# EAGLE design schematic1 (EAGLE 7.1.0)
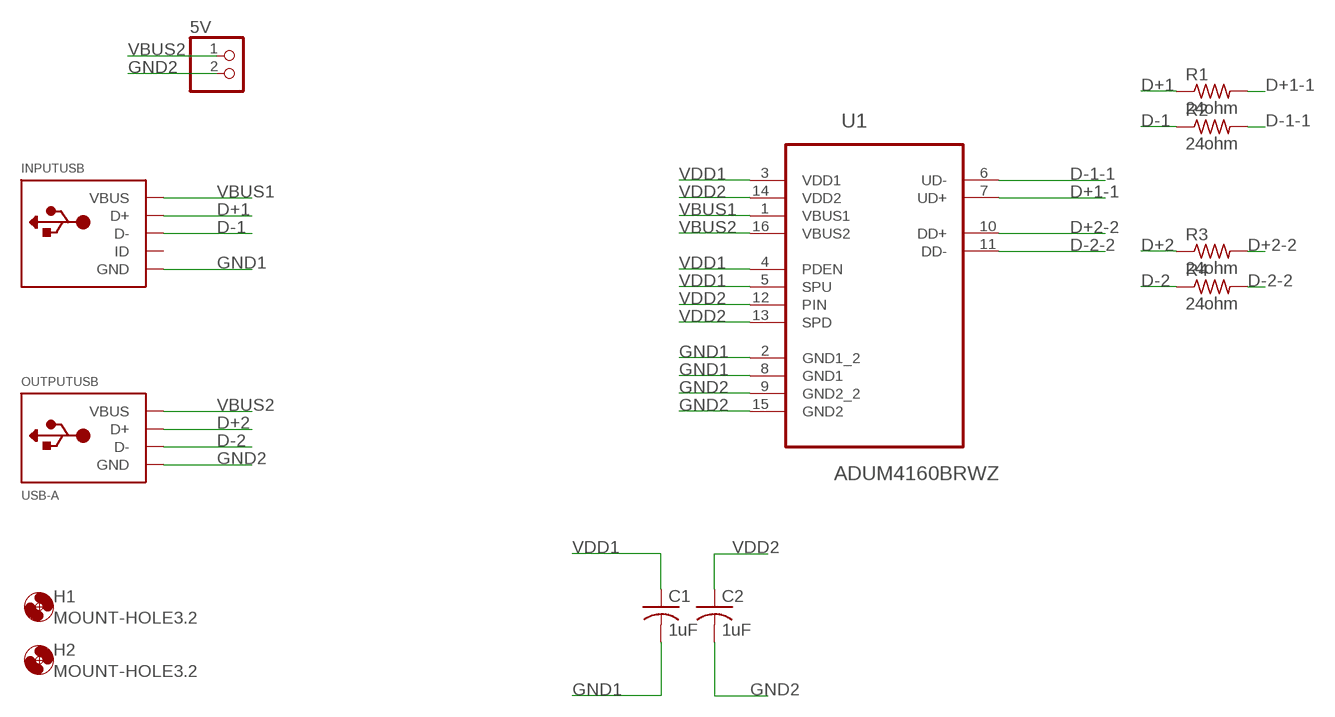
[diagram p0: schematic, sheet 1]

## Parts
5V  PINHD-1X2  [1X02]
C1  1uF  C-USC0805  [C0805]
C2  1uF  C-USC0805  [C0805]
H1  MOUNT-HOLE3.2  [3,2]
H2  MOUNT-HOLE3.2  [3,2]
INPUTUSB  USBMINIB  [USB-MINIB]
OUTPUTUSB  USB-A  [MOLEX_480371000]
R1  24ohm  R-US_R0805  [R0805]
R2  24ohm  R-US_R0805  [R0805]
R3  24ohm  R-US_R0805  [R0805]
R4  24ohm  R-US_R0805  [R0805]
U1  ADUM4160BRWZ  [SOIC127P1032X265-16N]

## Nets
D+1: INPUTUSB.D+ R1.1
D+1-1: R1.2 U1.7(UD+)
D+2: OUTPUTUSB.3(D+) R3.1
D+2-2: R3.2 U1.10(DD+)
D-1: INPUTUSB.D- R2.1
D-1-1: R2.2 U1.6(UD-)
D-2: OUTPUTUSB.2(D-) R4.1
D-2-2: R4.2 U1.11(DD-)
GND1: C1.2 INPUTUSB.GND U1.2(GND1_2) U1.8(GND1)
GND2: 5V.2 C2.2 OUTPUTUSB.4(GND) U1.9(GND2_2) U1.15(GND2)
VBUS1: INPUTUSB.VBUS U1.1(VBUS1)
VBUS2: 5V.1 OUTPUTUSB.1(VBUS) U1.16(VBUS2)
VDD1: C1.1 U1.3(VDD1) U1.4(PDEN) U1.5(SPU)
VDD2: C2.1 U1.12(PIN) U1.13(SPD) U1.14(VDD2)
Unconnected: INPUTUSB.ID

## Library data of the parts
5V = pinhead:PINHD-1X2: PIN HEADER
C1 C2 = adafruit:C-US: CAPACITOR, American symbol
H1 H2 = holes:MOUNT-HOLE: MOUNTING HOLE with drill center marker
INPUTUSB = adafruit:USB: USB Connectors USBMINIB - Surface Mount Female Mini-B USB Connector 4UConnector: 06564 By microbuilder.eu Thru-hole RA Female Mini-B USB Connector 4UConnector: 18732 By ladyada.net
OUTPUTUSB = adafruit:USB-A: USB type A 'plug' Used for things that can directly connect to a USB port, say USB key
R1-R4 = adafruit:R-US_: RESISTOR, American symbol
U1 = Analog Devices_By_element14_Batch_1:ADUM4160BRWZ: Full/Low Speed 5 kV USB Digital Isolator; MPN: ADUM4160BRWZ; OC_FARNELL: 1858056; OC_NEWARK: 24R8652; PACKAGE: SOIC-16; SUPPLIER: Analog Devices

## Board
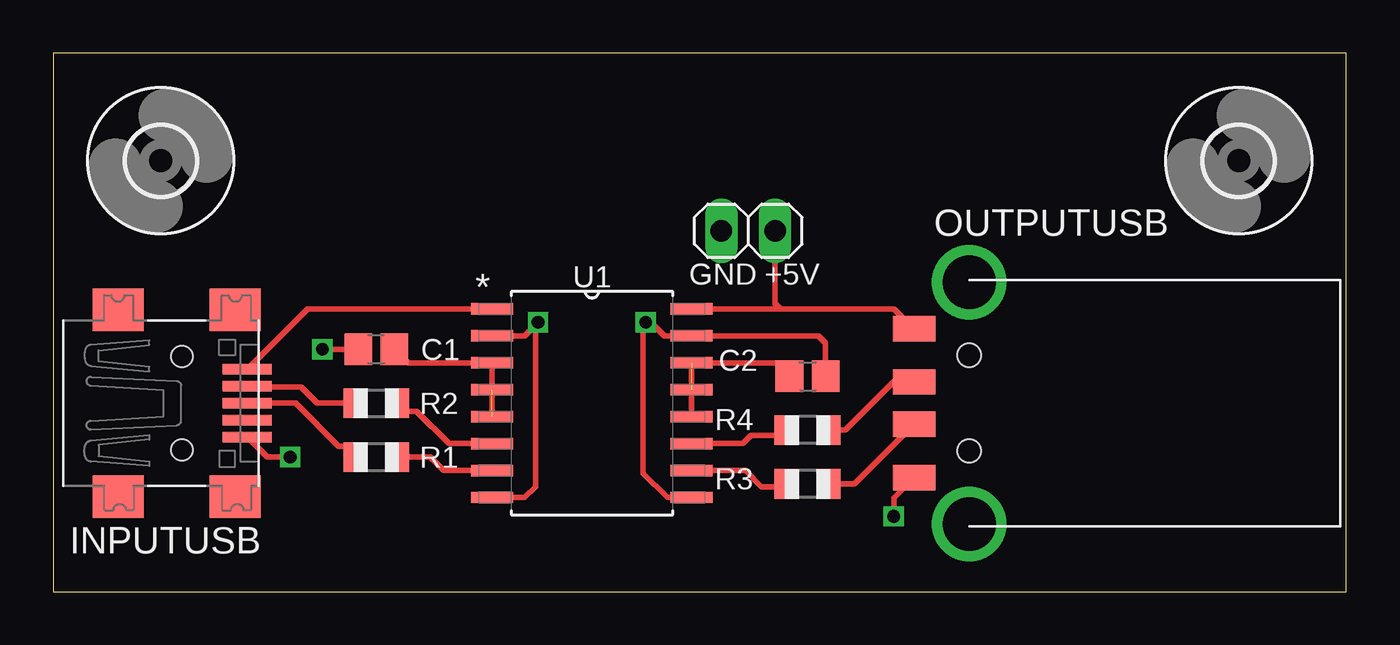
[diagram p1: board, top side]
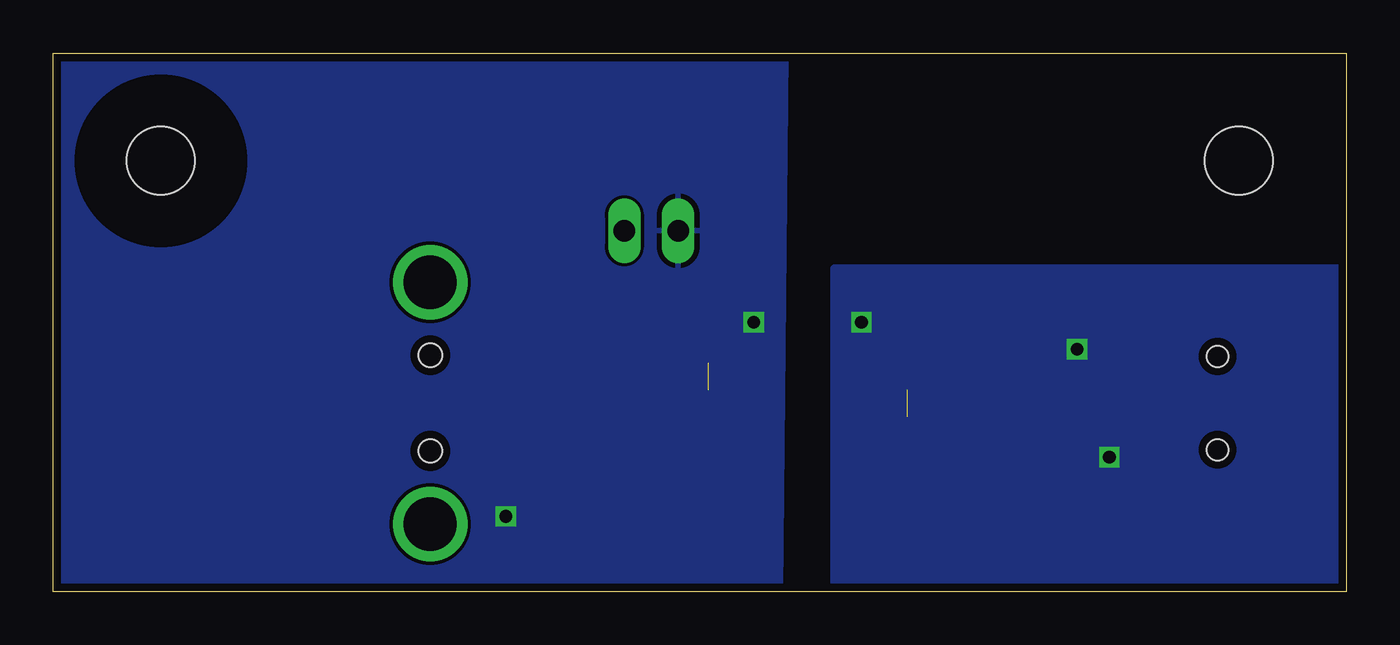
[diagram p2: board, bottom side, seen from below]

Size 60.96 x 25.4 mm. Coordinates in mm from the lower left corner, seen from the top.
Outline: 0,0 60.96,0 60.96,25.4 0,25.4 0,0
Copper layers (1*16): Top 0.0356mm / dielectric 1.5011mm / Bottom 0.0356mm
Design rules "LaenPCBOrder": minimum track width 6mil, minimum drill 13mil, track to track 6mil, track to pad 6mil, pad to pad 6mil, via to via 6mil, smd to smd 6mil, copper to edge 15mil, drill to drill 6mil, minimum pad ring 7mil, minimum via ring 7mil, stop-mask expansion 3mil, vias tented up to drill 0mil, thermal gap 10mil

### Footprints (pad centres in the part's own frame; a part is rotated, then mirrored left to right if it is on the bottom)
1X02 = drill 1.016 long: 1 -1.27,0; 2 1.27,0
C0805 = smd 1.3 x 1.5: 1 -0.85,0; 2 0.85,0
3,2 = hole 3.2: 0,0
USB-MINIB = smd 0.5 x 2.308: D+ 0,4.064; D- -0.8,4.064; GND 1.6,4.064; ID 0.8,4.064; VBUS -1.6,4.064 | smd 2 x 2.4: GND1 -4.4,-2; GND2 -4.4,3.5; GND3 4.4,3.5; GND4 4.4,-2 | hole 1: -2.2,1; 2.2,1
MOLEX_480371000 = smd 1.2 x 2: 1 3.5,2.6; 2 1,2.6; 3 -1,2.6; 4 -3.5,2.6 | drill 2.5: M1 -5.7,0; M2 5.7,0 | hole 1.1: -2.25,0; 2.25,0
R0805 = smd 1.1 x 1.4: 1 -1,0; 2 1,0
SOIC127P1032X265-16N = smd 1.981 x 0.533: 1 -4.699,4.445; 2 -4.699,3.175; 3 -4.699,1.905; 4 -4.699,0.635; 5 -4.699,-0.635; 6 -4.699,-1.905; 7 -4.699,-3.175; 8 -4.699,-4.445; 9 4.699,-4.445; 10 4.699,-3.175; 11 4.699,-1.905; 12 4.699,-0.635; 13 4.699,0.635; 14 4.699,1.905; 15 4.699,3.175; 16 4.699,4.445

### Placement (x,y rotation side)
5V  32.77,17.02 180 top
C1  15.24,11.43 180 top
C2  35.56,10.16 0 top
H1  5.08,20.32 0 top
H2  55.88,20.32 0 top
INPUTUSB  5.08,8.89 270 top
OUTPUTUSB  43.18,8.89 90 top
R1  15.24,6.35 0 top
R2  15.24,8.89 0 top
R3  35.56,5.08 180 top
R4  35.56,7.62 180 top
U1  25.4,8.89 0 top

### Tracks (layer width: path | path; a pad name or v marks a point on that pad's centre or on a via)
D+1
  Top 0.254: INPUTUSB.D+ 11.43,8.89 13.46,6.86 13.73,6.86 R1.1
D+1-1
  Top 0.254: R1.2 17.78,6.35 18.41,5.71 U1.7
D+2
  Top 0.254: R3.1 37.77,5.08 OUTPUTUSB.3
D+2-2
  Top 0.254: U1.10 32.64,5.71 33.4,4.95 34.43,4.95 R3.2
D-1
  Top 0.254: R2.1 12.45,8.89 11.68,9.65 9.18,9.65 INPUTUSB.D-
D-1-1
  Top 0.254: U1.6 18.67,6.99 17.14,8.51 16.62,8.51 R2.2
D-2
  Top 0.254: R4.1 37.34,7.62 39.88,10.16 40.64,10.16 40.58,10.1 OUTPUTUSB.2
D-2-2
  Top 0.254: U1.11 32.51,6.99 32.89,7.37 34.31,7.37 R4.2
GND1  (via drill 0.6)
  Top 0.254: U1.2 22.23,12.06 v22.86,12.7 22.73,12.57 22.73,4.95 22.23,4.45 U1.8 | v11.18,6.35 10.08,6.35 INPUTUSB.GND | C1.2 v12.7,11.43
  pour Bottom: 0,15.24 24.13,15.24 24.13,0 0,0
GND2  (via drill 0.6)
  Top 0.254: v39.62,3.56 39.62,4.43 OUTPUTUSB.4 | U1.9 28.96,4.45 27.81,5.59 27.81,12.57 v27.94,12.7 28.19,12.7 28.83,12.06 U1.15 36.07,12.06 36.41,11.72 C2.2
  pour Bottom: 26.42,25.4 60.96,25.4 60.96,0 26.67,0
VBUS1
  Top 0.254: U1.1 11.99,13.34 INPUTUSB.VBUS
VBUS2
  Top 0.254: U1.16 34.29,13.34 | 34.29,13.34 39.63,13.34 OUTPUTUSB.1 | 5V.1 34.04,13.59 34.29,13.34
VDD1  (1 unrouted)
  Top 0.254: C1.1 16.73,10.79 U1.3 U1.5
VDD2  (1 unrouted)
  Top 0.254: C2.1 34.08,10.79 U1.14 U1.12

### Text on the board
tNames: GND | +5V